# Altium project Power.PrjPCB
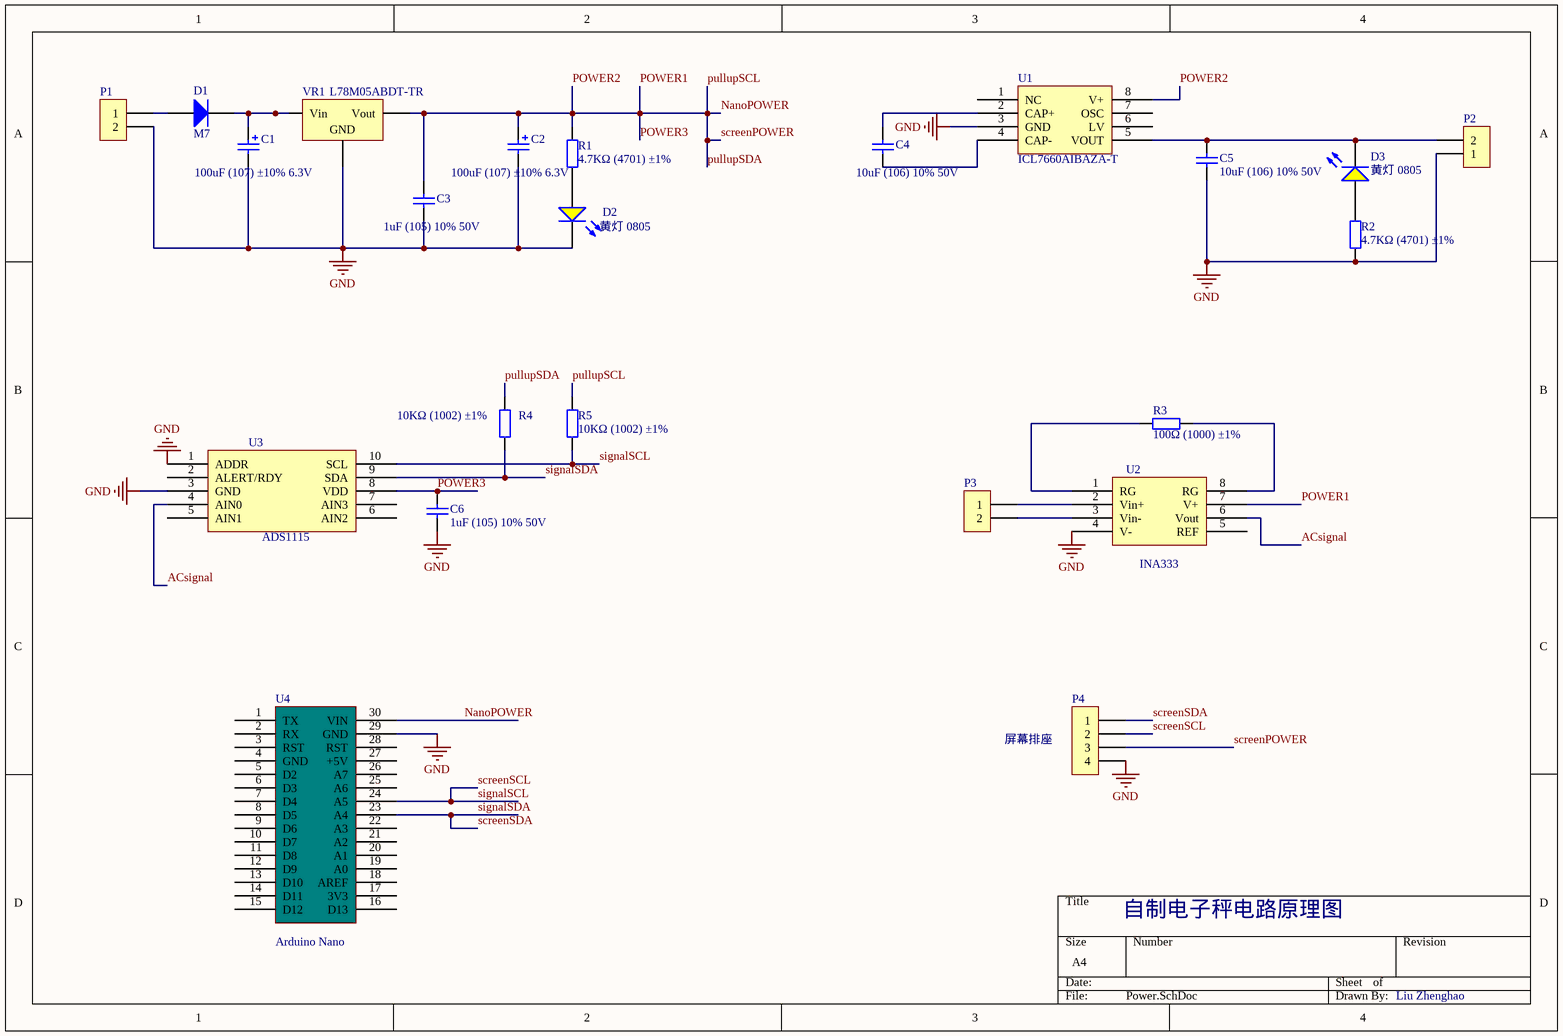
[diagram p0: Power.SchDoc]
1 sheet, 23 parts. Net scope: global (net labels, ports and power ports of the same name join across sheets).
Board file: Power.PcbDoc

## Sheet Power.SchDoc
size A4

### Parts
C1  100uF (107) ±10% 6.3V  [LC-CASE-B_3528]
C2  100uF (107) ±10% 6.3V  [LC-CASE-B_3528]
C3  1uF (105) 10% 50V  [LC-1206_C]
C4  10uF (106) 10% 50V  [LC-1206_C]
C5  10uF (106) 10% 50V  [LC-1206_C]
C6  1uF (105) 10% 50V  [LC-1206_C]
D1  M7  [LC-SMA(DO-214AC)_S1]
D2  黄灯 0805  [LC-0805_LED_S1]
D3  黄灯 0805  [LC-0805_LED_S1]
P1  (no value)  [Female1X2]
P2  (no value)  [Female1X2]
P3  (no value)  [Female1X2]
P4  屏幕排座  [Female1X4]
R1  4.7KΩ (4701) ±1%  [LC-1206_R]
R2  4.7KΩ (4701) ±1%  [LC-1206_R]
R3  100Ω (1000) ±1%  [LC-1206_R]
R4  10KΩ (1002) ±1%  [LC-1206_R]
R5  10KΩ (1002) ±1%  [LC-1206_R]
U1  ICL7660AIBAZA-T  [LC-SOIC-8_150mil]
U2  INA333  [VSSOP-8]
U3  ADS1115  [MSOP10]
U4  Arduino Nano  [PCBComponent_1]
VR1  L78M05ABDT-TR  [LC-TO-252-2-180]

### Nets
GND: C1.2 C2.2 C3.1 C5.1 C6.1 D2.K P1.2 P2.1 P4.4 R2.2 U1.3(GND) U2.4(V-) U3.1(ADDR) U3.3(GND) U4.29(GND) VR1.2(GND)
ACsignal: U2.6(Vout) U3.4(AIN0)
NanoPOWER: C2.1 C3.2 C6.2 P4.3 R1.2 R4.2 R5.2 U1.8(V+) U2.7(V+) U3.8(VDD) U4.30(VIN) VR1.3(Vout)  [also labelled POWER1, POWER2, POWER3, pullupSCL, pullupSDA, screenPOWER]
screenSCL: P4.2 R5.1 U3.10(SCL) U4.24(A5)  [also labelled signalSCL]
screenSDA: P4.1 R4.1 U3.9(SDA) U4.23(A4)  [also labelled signalSDA]
NetC1_1: C1.1 D1.2(K) VR1.1(Vin)
NetC4_1: C4.1 U1.4(CAP-)
NetC4_2: C4.2 U1.2(CAP+)
NetC5_2: C5.2 D3.K P2.2 U1.5(VOUT)
NetD1_1: D1.1(A) P1.1
NetD2_A: D2.A R1.1
NetD3_A: D3.A R2.1
NetP3_1: P3.1 U2.2(Vin+)
NetP3_2: P3.2 U2.3(Vin-)
NetR3_1: R3.1 U2.1(RG)
NetR3_2: R3.2 U2.8(RG)

Not connected (* = marked no-connect by the designer): U1 1(NC) 6(LV) 7(OSC); U2 5(REF); U3 2(ALERT/RDY) 5(AIN1) 6(AIN2) 7(AIN3); U4 1(TX) 2(RX) 3(RST) 4(GND) 5(D2) 6(D3) 7(D4) 8(D5) 9(D6) 10(D7) 11(D8) 12(D9) 13(D10) 14(D11) 15(D12) 16(D13) 17(3V3) 18(AREF) 19(A0) 20(A1) 21(A2) 22(A3) 25(A6) 26(A7) 27(+5V) 28(RST)

### Notes on the sheet
- 自制电子秤电路原理图
- Liu Zhenghao

### Library data of the parts
C1 C2 = 3528 100uF (107) 10% 6.3V: 钽电容; ComponentLink1Description: 供应商链接; ComponentLink1URL: http://www.szlcsc.com/product/details_16815.html; Package: 3528; Supplier: LC; SuppliersPartNumber: C16133
C3 C6 = 1206 1uF (105) 10% 50V: 贴片电容; ComponentLink1Description: 供应商链接; ComponentLink1URL: http://www.szlcsc.com/product/details_2200.html; Package: 1206; Supplier: LC; SuppliersPartNumber: C1848
C4 C5 = 1206 10uF (106) 10% 50V: 贴片电容; ComponentLink1Description: 供应商链接; ComponentLink1URL: http://www.szlcsc.com/product/details_14236.html; Package: 1206; Supplier: LC; SuppliersPartNumber: C13585
D1 = SMA(DO-214AC) M7: 二极管; ComponentLink1Description: 供应商链接; ComponentLink1URL: http://www.szlcsc.com/product/details_2841.html; Package: SMA(DO-214AC); Supplier: LC; SuppliersPartNumber: C2464
D2 D3 = 0805 黄灯: 发光二极管; ComponentLink1Description: 供应商链接; ComponentLink1URL: http://www.szlcsc.com/product/details_2669.html; Package: 0805; Supplier: LC; SuppliersPartNumber: C2296
P1-P3 = 排座与排针1X2
P4 = 排座与排针1X4
R1 R2 = 1206 4.7KΩ (4701) 1%: 贴片电阻; ComponentLink1Description: 供应商链接; ComponentLink1URL: http://www.szlcsc.com/product/details_18624.html; Package: 1206; Supplier: LC; SuppliersPartNumber: C17936
R3 = 1206 100Ω (1000) 1%: 贴片电阻; ComponentLink1Description: 供应商链接; ComponentLink1URL: http://www.szlcsc.com/product/details_18589.html; Package: 1206; Supplier: LC; SuppliersPartNumber: C17901
R4 R5 = 1206 10KΩ (1002) 1%: 贴片电阻; ComponentLink1Description: 供应商链接; ComponentLink1URL: http://www.szlcsc.com/product/details_18590.html; Package: 1206; Supplier: LC; SuppliersPartNumber: C17902
U1 = ICL7660AIBAZA-T: 电源芯片; ComponentLink1Description: 供应商链接; ComponentLink1URL: http://www.szlcsc.com/product/details_8358.html; Package: SOIC-8_150mil; Supplier: LC; SuppliersPartNumber: C7881
U2 = INA333: 仪用放大器
U4 = Component_1_1
VR1 = TO-252-2 L78M05ABDT-TR: 低压差线性稳压(LDO); ComponentLink1Description: 供应商链接; ComponentLink1URL: http://www.szlcsc.com/product/details_59107.html; Package: TO-252-2; Supplier: LC; SuppliersPartNumber: C58069